# EAGLE design current_sense_INA260 (EAGLE 8.2.2)
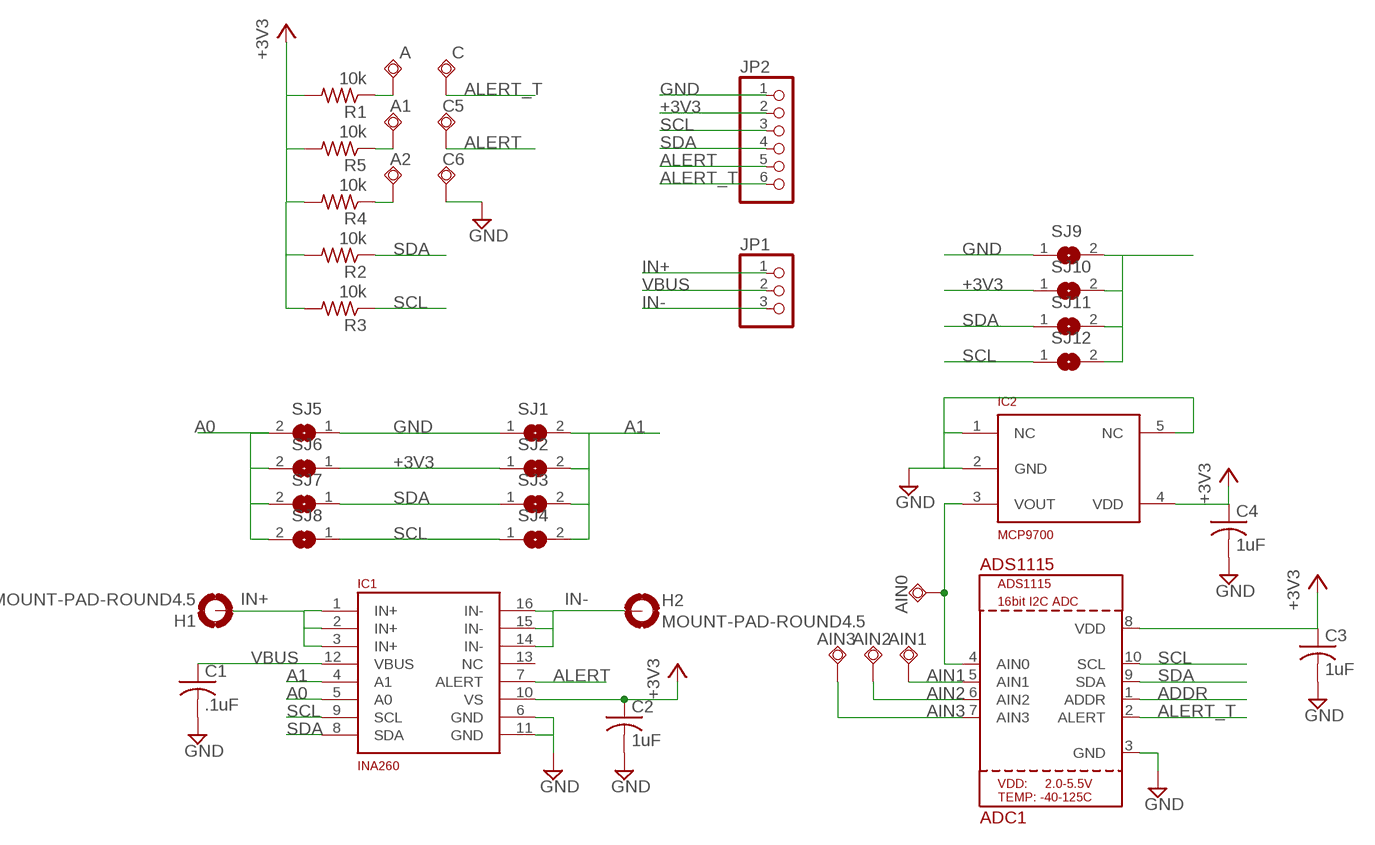
[diagram p0: schematic, sheet 1]

## Parts
A  TPSQTP20SQ  [TP20SQ]
A1  TPSQTP20SQ  [TP20SQ]
A2  TPSQTP20SQ  [TP20SQ]
ADC1  ADS1115  [MSOP10]
AIN0  TPSQTP20SQ  [TP20SQ]
AIN1  TPSQTP20SQ  [TP20SQ]
AIN2  TPSQTP20SQ  [TP20SQ]
AIN3  TPSQTP20SQ  [TP20SQ]
C  C  TPSQTP20SQ  [TP20SQ]
C1  .1uF  C-USC0805K  [C0805K]
C2  1uF  C-USC0805K  [C0805K]
C3  1uF  C-USC0805K  [C0805K]
C4  1uF  C-USC0805K  [C0805K]
C5  TPSQTP20SQ  [TP20SQ]
C6  TPSQTP20SQ  [TP20SQ]
H1  MOUNT-PAD-ROUND4.5  [4,5-PAD]
H2  MOUNT-PAD-ROUND4.5  [4,5-PAD]
IC1  INA260  [TSSOP16]
IC2  MCP9700  [SC70]
JP1  PINHD-1X3  [1X03]
JP2  PINHD-1X6  [1X06]
R1  10k  R-US_R0805  [R0805]
R2  10k  R-US_R0805  [R0805]
R3  10k  R-US_R0805  [R0805]
R4  10k  R-US_R0805  [R0805]
R5  10k  R-US_R0805  [R0805]
SJ1  SJ  [SJ]
SJ2  SJ  [SJ]
SJ3  SJ  [SJ]
SJ4  SJ  [SJ]
SJ5  SJ  [SJ]
SJ6  SJ  [SJ]
SJ7  SJ  [SJ]
SJ8  SJ  [SJ]
SJ9  SJ  [SJ]
SJ10  SJ  [SJ]
SJ11  SJ  [SJ]
SJ12  SJ  [SJ]

## Nets
+3V3: ADC1.8(VDD) C2.1 C3.1 C4.1 IC1.10(VS) IC2.4(VDD) JP2.2 R1.2 R2.2 R3.2 R4.2 R5.2 SJ2.1 SJ6.1 SJ10.1
A0: IC1.5(A0) SJ5.2 SJ6.2 SJ7.2 SJ8.2
A1: IC1.4(A1) SJ1.2 SJ2.2 SJ3.2 SJ4.2
ADDR: ADC1.1(ADDR) SJ9.2 SJ10.2 SJ11.2 SJ12.2
AIN1: ADC1.5(AIN1) AIN1.TP
AIN2: ADC1.6(AIN2) AIN2.TP
AIN3: ADC1.7(AIN3) AIN3.TP
ALERT: C5.TP IC1.7(ALERT) JP2.5
ALERT_T: ADC1.2(ALERT) C.TP JP2.6
GND: ADC1.3(GND) C1.2 C2.2 C3.2 C4.2 C6.TP IC1.6(GND) IC1.11(GND) IC2.1(NC) IC2.2(GND) IC2.5(NC) JP2.1 SJ1.1 SJ5.1 SJ9.1
IN+: H1.B4,5(MOUNT) IC1.1(IN+) IC1.2(IN+) IC1.3(IN+) JP1.1
IN-: H2.B4,5(MOUNT) IC1.14(IN-) IC1.15(IN-) IC1.16(IN-) JP1.3
N$1: A2.TP R4.1
N$2: A1.TP R5.1
N$3: A.TP R1.1
SCL: ADC1.10(SCL) IC1.9(SCL) JP2.3 R3.1 SJ4.1 SJ8.1 SJ12.1
SDA: ADC1.9(SDA) IC1.8(SDA) JP2.4 R2.1 SJ3.1 SJ7.1 SJ11.1
V_TEMP: ADC1.4(AIN0) AIN0.TP IC2.3(VOUT)
VBUS: C1.1 IC1.12(VBUS) JP1.2
Unconnected: IC1.13(NC)

## Library data of the parts
A A1 A2 AIN0 AIN1-AIN3 C C5 C6 = testpad:TPSQ: Test pad
ADC1 = vtgs:ADS1115
C1-C4 = rcl:C-US: CAPACITOR, American symbol
H1 H2 = holes:MOUNT-PAD-ROUND: MOUNTING PAD, round
IC1 = vtgs:INA260
IC2 = vtgs:MCP9700
JP1 = pinhead:PINHD-1X3: PIN HEADER
JP2 = pinhead:PINHD-1X6: PIN HEADER
R1-R5 = rcl:R-US_: RESISTOR, American symbol
SJ1-SJ12 = jumper:SJ: SMD solder JUMPER

## Board
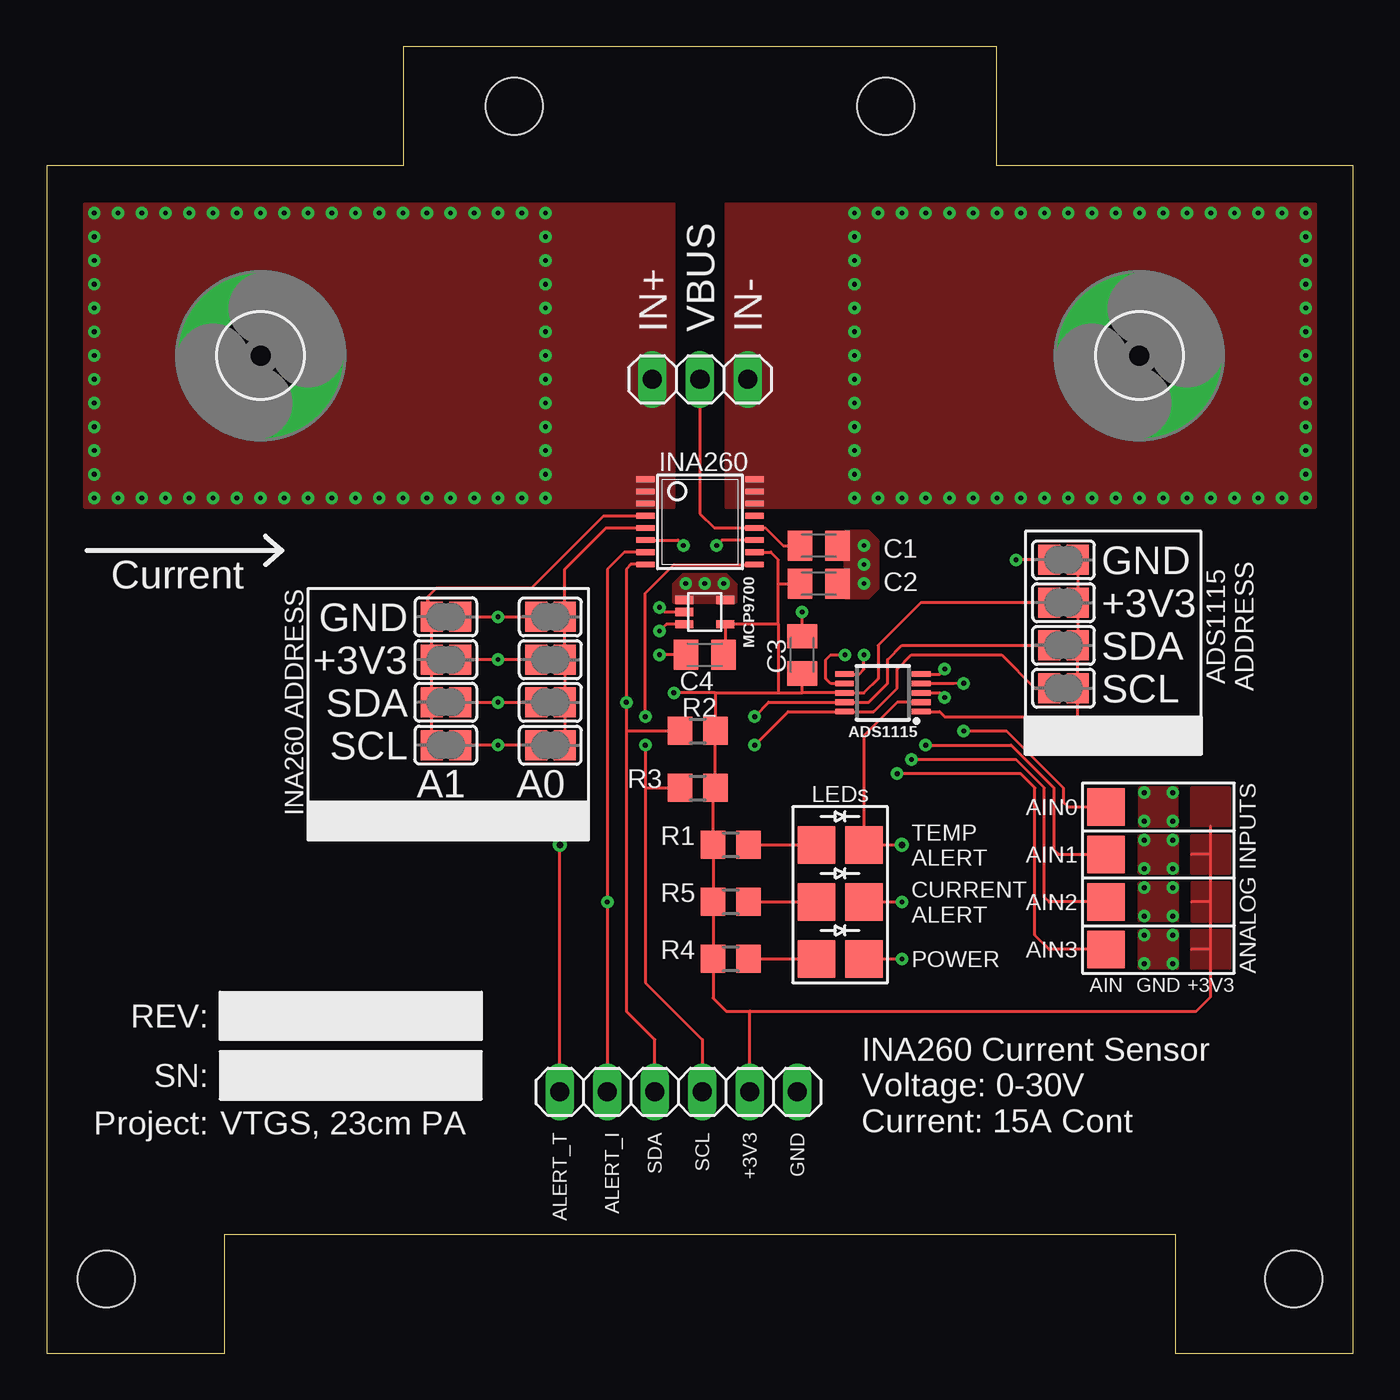
[diagram p1: board, top side]
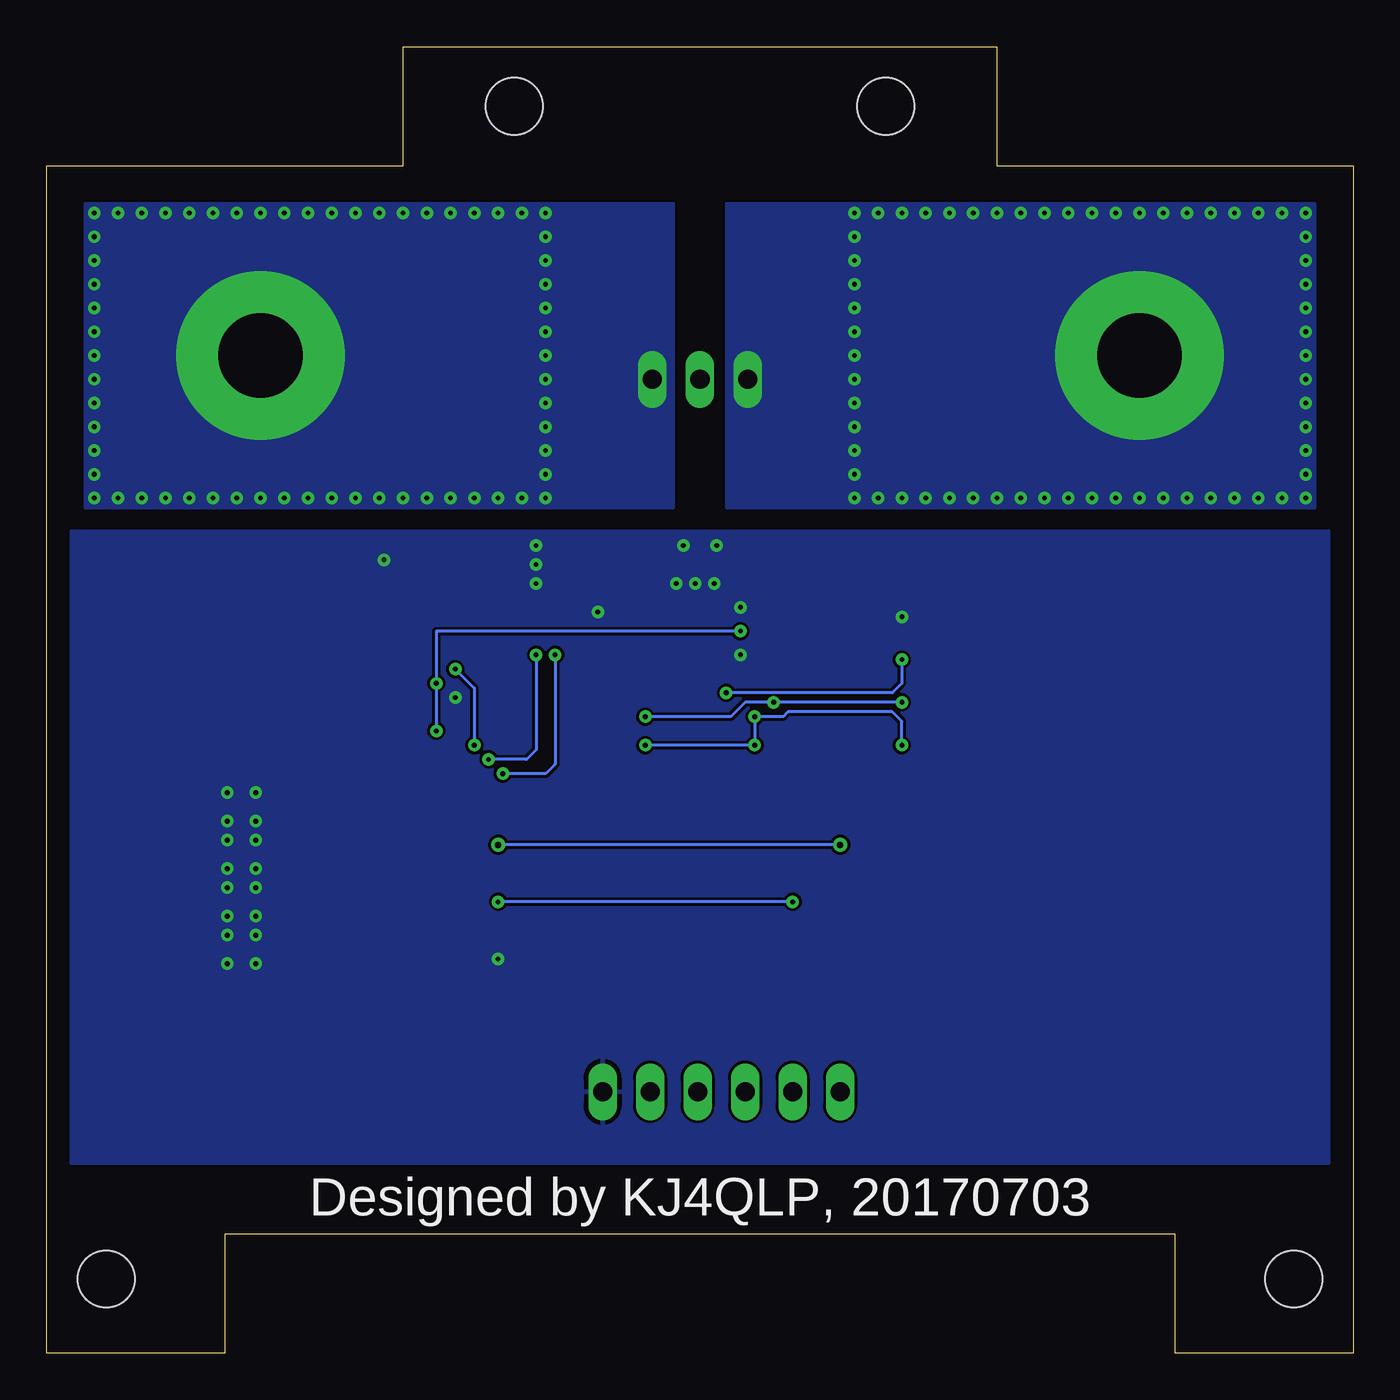
[diagram p2: board, bottom side, seen from below]

Size 69.85 x 69.85 mm. Coordinates in mm from the lower left corner, seen from the top.
Outline: 0,0 9.53,0 9.53,6.35 60.33,6.35 60.33,0 69.85,0 69.85,63.5 50.8,63.5 50.8,69.85 19.05,69.85 19.05,63.5 0,63.5 0,0
Copper layers (1*16): Top 0.035mm / dielectric 1.5mm / Bottom 0.035mm
Design rules "default *": minimum track width 6mil, minimum drill 10mil, track to track 6mil, track to pad 6mil, pad to pad 6mil, via to via 6mil, smd to smd 6mil, copper to edge 3mil, drill to drill 6mil, minimum pad ring 10mil, minimum via ring 8mil, stop-mask expansion 4mil, vias tented up to drill 0mil, thermal gap 10mil
Holes 3.05 mm at 25,66.67 44.85,66.67 3.17,3.97 66.67,3.97

### Footprints (pad centres in the part's own frame; a part is rotated, then mirrored left to right if it is on the bottom)
TP20SQ = smd 2 x 2: TP 0,0
MSOP10 = smd 0.3 x 1: 1 -1,-2.05; 2 -0.5,-2.05; 3 0,-2.05; 4 0.5,-2.05; 5 1,-2.05; 6 1,2.05; 7 0.5,2.05; 8 0,2.05; 9 -0.5,2.05; 10 -1,2.05
C0805K = smd 1.3 x 1.6: 1 -1,0; 2 1,0
4,5-PAD = drill 4.5 pad 9: B4,5 0,0
TSSOP16 = smd 0.305 x 0.991: 1 -2.275,-2.918; 2 -1.625,-2.918; 3 -0.975,-2.918; 4 -0.325,-2.918; 5 0.325,-2.918; 6 0.975,-2.918; 7 1.625,-2.918; 8 2.275,-2.918; 9 2.275,2.918; 10 1.625,2.918; 11 0.975,2.918; 12 0.325,2.918; 13 -0.325,2.918; 14 -0.975,2.918; 15 -1.625,2.918; 16 -2.275,2.918
SC70 = smd 0.45 x 0.95: 1 0.65,1.1; 2 0,1.1; 3 -0.65,1.1; 4 -0.65,-1.1; 5 0.65,-1.1
1X03 = drill 1.016 long: 1 -2.54,0; 2 0,0; 3 2.54,0
1X06 = drill 1.016 long: 1 -6.35,0; 2 -3.81,0; 3 -1.27,0; 4 1.27,0; 5 3.81,0; 6 6.35,0
R0805 = smd 1.3 x 1.5: 1 -0.95,0; 2 0.95,0
SJ = smd 1.168 x 1.6: 1 -0.762,0; 2 0.762,0

### Placement (x,y rotation side)
A  41.15,27.18 0 top
A1  41.15,24.13 0 top
A2  41.15,21.08 0 top
ADC1  44.7,35.31 90 top
AIN0  56.64,29.21 0 top
AIN1  56.64,26.67 0 top
AIN2  56.64,24.13 0 top
AIN3  56.64,21.59 0 top
C  43.69,27.18 0 top
C1  41.27,43.18 0 top
C2  41.27,41.15 0 top
C3  40.39,37.34 90 top
C4  35.18,37.34 180 top
C5  43.69,24.13 0 top
C6  43.69,21.08 0 top
H1  11.43,53.34 0 top
H2  58.42,53.34 0 top
IC1  34.92,44.45 270 top
IC2  35.18,39.62 90 top
JP1  34.92,52.07 0 top
JP2  33.78,13.97 180 top
R1  36.58,27.18 180 top
R2  34.8,33.27 0 top
R3  34.8,30.23 0 top
R4  36.58,21.08 180 top
R5  36.58,24.13 180 top
SJ1  21.34,39.37 180 top
SJ2  21.34,37.08 180 top
SJ3  21.34,34.8 180 top
SJ4  21.34,32.51 180 top
SJ5  26.92,39.37 0 top
SJ6  26.92,37.08 0 top
SJ7  26.92,34.8 0 top
SJ8  26.92,32.51 0 top
SJ9  54.36,42.42 0 top
SJ10  54.36,40.13 0 top
SJ11  54.36,37.85 0 top
SJ12  54.36,35.56 0 top

### Tracks (layer width: path | path; a pad name or v marks a point on that pad's centre or on a via)
+3V3  (via drill 0.25)
  Top 0.152: IC1.10 38.71,42.83 39.12,42.42 39.12,41.15 | SJ6.1 v24.13,37.08 SJ2.1 | 39.12,41.15 C2.1 | SJ10.1 46.74,40.13 44.45,37.85 44.45,36.07 43.69,35.31 ADC1.8 40.39,35.31 | 35.74,35.31 v33.53,35.31 | 40.39,35.31 C3.1 | 35.74,35.31 R2.2 R3.2 35.63,30.1 R1.2 R5.2 R4.2 35.63,18.98 36.32,18.29 37.59,18.29 | 35.74,35.31 39.12,35.31 | 39.12,35.31 40.39,35.31 | JP2.2 37.59,18.29 | 39.12,38.98 39.12,35.31 | 39.12,38.98 39.12,41.15 | 39.12,38.98 IC2.4 36.28,37.44 C4.1 | 37.59,18.29 61.47,18.29 62.23,19.05 62.23,21.59 | 62.23,26.67 61.21,26.67 | 62.23,26.67 62.23,28.19 | 62.23,24.13 61.21,24.13 | 62.23,24.13 62.23,26.67 | 62.23,21.59 61.21,21.59 | 62.23,21.59 62.23,24.13
  Bottom 0.152: v24.13,37.08 24.13,35.81 24.64,35.31 v33.53,35.31
  pour Top: 61.21,30.23 63.25,30.23 63.25,28.19 61.21,28.19
  pour Top: 61.21,27.69 63.25,27.69 63.25,25.65 61.21,25.65
  pour Top: 61.21,25.15 61.21,23.11 63.25,23.11 63.25,25.15
  pour Top: 61.21,22.61 63.25,22.61 63.25,20.57 61.21,20.57
A0
  Top 0.152: IC1.5 29.9,44.12 27.69,41.91 SJ5.2 SJ6.2 SJ7.2 SJ8.2
A1
  Top 0.152: SJ4.2 SJ3.2 SJ2.2 SJ1.2 20.32,40.39 20.83,40.89 25.91,40.89 29.79,44.77 IC1.4
ADDR
  Top 0.152: SJ9.2 SJ10.2 SJ11.2 SJ12.2 55.12,34.04 48.01,34.04 47.74,34.31 ADC1.1 46.77,34.29
AIN1  (via drill 0.25)
  Top 0.152: ADC1.5 47.74,36.31 v48.01,36.58 | v46.99,32.51 51.56,32.51 53.85,30.23 53.85,26.92 54.1,26.67 AIN1.TP
  Bottom 0.152: v48.01,36.58 46.99,35.56 v46.99,32.51
AIN2  (via drill 0.25)
  Top 0.152: ADC1.6 43.45,36.31 43.69,36.58 v43.69,37.34 | AIN2.TP 53.59,24.13 53.34,24.38 53.34,30.23 51.82,31.75 v46.23,31.75
  Bottom 0.152: v43.69,37.34 43.69,32.26 44.2,31.75 v46.23,31.75
AIN3  (via drill 0.25)
  Top 0.152: ADC1.7 41.92,35.81 41.66,36.07 41.66,37.08 41.91,37.34 v42.67,37.34 | AIN3.TP 53.59,21.59 52.83,22.35 52.83,30.23 52.07,30.99 v45.47,30.99
  Bottom 0.152: v42.67,37.34 42.67,31.5 43.18,30.99 v45.47,30.99
ALERT  (via drill 0.25)
  Top 0.152: IC1.7 30.89,42.83 29.97,41.91 v29.97,24.13 JP2.5 | C5.TP v45.72,24.13
  Bottom 0.152: v29.97,24.13 v45.72,24.13
ALERT_T  (via drill 0.35)
  Top 0.152: ADC1.2 45.47,34.81 43.69,33.02 C.TP v45.72,27.18 | JP2.6 v27.43,27.18
  Bottom 0.152: v27.43,27.18 v45.72,27.18
GND  (via drill 0.25)
  Top 0.152: IC1.11 36.11,43.48 v35.81,43.18 | SJ1.1 v24.13,39.37 SJ5.1 | IC1.6 33.74,43.48 v34.04,43.18 | SJ9.1 v51.82,42.42 | C3.2 v40.39,39.62 | ADC1.3 47.75,35.31 v48.01,35.05 | C4.2 v32.77,37.34 | IC2.2 33.02,39.62 v32.77,39.88 | C6.TP v45.72,21.08
  other vias: 43.69,43.18 43.69,42.16 43.69,41.15 35.18,41.15 34.16,41.15 36.2,41.15 60.2,29.97 60.2,27.43 60.2,24.89 60.2,22.35 60.2,23.37 60.2,25.91 60.2,28.45 60.2,20.83 58.67,29.97 58.67,28.45 58.67,27.43 58.67,25.91 58.67,24.89 58.67,23.37 58.67,22.35 58.67,20.83
  pour Top (no thermals): 42.67,43.94 42.67,40.39 43.94,40.39 44.45,40.89 44.45,43.43 43.94,43.94
  pour Bottom: 1.27,10.16 1.27,43.94 68.58,43.94 68.58,10.16
  pour Top (no thermals): 33.53,40.13 33.53,41.15 34.04,41.66 36.32,41.66 36.83,41.15 36.83,40.13
  pour Top: 58.42,30.23 58.42,28.19 60.45,28.19 60.45,30.23
  pour Top: 58.42,27.69 60.45,27.69 60.45,25.65 58.42,25.65
  pour Top: 58.42,25.15 60.45,25.15 60.45,23.11 58.42,23.11
  pour Top: 58.42,22.61 60.45,22.61 60.45,20.57 58.42,20.57
IN+  (via drill 0.25)
  other vias: 26.67,49.53 26.67,50.8 26.67,52.07 26.67,53.34 26.67,54.61 26.67,55.88 26.67,57.15 26.67,58.42 26.67,59.69 26.67,60.96 5.08,60.96 3.81,60.96 2.54,46.99 2.54,60.96 2.54,59.69 2.54,58.42 2.54,57.15 2.54,55.88 2.54,54.61 2.54,53.34 2.54,52.07 2.54,50.8 2.54,49.53 2.54,48.26 13.97,45.72 2.54,45.72 3.81,45.72 5.08,45.72 6.35,45.72 7.62,45.72 8.89,45.72 10.16,45.72 11.43,45.72 12.7,45.72 6.35,60.96 7.62,60.96 8.89,60.96 10.16,60.96 11.43,60.96 12.7,60.96 13.97,60.96 15.24,60.96 16.51,60.96 17.78,60.96 19.05,60.96 20.32,60.96 21.59,60.96 22.86,60.96 24.13,60.96 25.4,60.96 15.24,45.72 16.51,45.72 17.78,45.72 19.05,45.72 20.32,45.72 21.59,45.72 22.86,45.72 24.13,45.72 25.4,45.72 26.67,45.72 26.67,46.99 26.67,48.26
  pour Top (no thermals): 2.03,61.47 33.53,61.47 33.53,45.21 2.03,45.21
  pour Bottom (no thermals): 2.03,61.47 33.53,61.47 33.53,45.21 2.03,45.21
IN-  (via drill 0.25)
  other vias: 43.18,60.96 43.18,59.69 43.18,58.42 43.18,57.15 43.18,55.88 43.18,54.61 43.18,53.34 43.18,52.07 43.18,50.8 43.18,49.53 43.18,48.26 43.18,46.99 43.18,45.72 44.45,60.96 45.72,60.96 46.99,60.96 48.26,60.96 49.53,60.96 50.8,60.96 52.07,60.96 53.34,60.96 54.61,60.96 55.88,60.96 57.15,60.96 58.42,60.96 59.69,60.96 60.96,60.96 62.23,60.96 63.5,60.96 64.77,60.96 66.04,60.96 67.31,60.96 67.31,59.69 67.31,58.42 67.31,57.15 67.31,55.88 67.31,54.61 67.31,53.34 67.31,52.07 67.31,50.8 67.31,49.53 67.31,48.26 67.31,46.99 67.31,45.72 66.04,45.72 64.77,45.72 63.5,45.72 62.23,45.72 60.96,45.72 59.69,45.72 58.42,45.72 57.15,45.72 55.88,45.72 54.61,45.72 53.34,45.72 52.07,45.72 50.8,45.72 49.53,45.72 48.26,45.72 46.99,45.72 45.72,45.72 44.45,45.72
  pour Top (no thermals): 36.32,45.21 36.32,61.47 67.82,61.47 67.82,45.21
  pour Bottom (no thermals): 36.32,45.21 36.32,61.47 67.82,61.47 67.82,45.21
N$1
  Top 0.152: R4.1 A2.TP
N$2
  Top 0.152: R5.1 A1.TP
N$3
  Top 0.152: R1.1 A.TP
SCL  (via drill 0.25)
  Top 0.152: IC1.9 37.83,42.16 33.53,42.16 32,40.64 v32,34.04 | SJ8.1 v24.13,32.51 SJ4.1 | JP2.3 35.05,16.76 32,19.81 32,30.23 | v37.85,32.51 39.64,34.31 ADC1.10 44.21,34.31 45.47,35.56 45.47,36.58 46.23,37.34 51.05,37.34 52.83,35.56 SJ12.1 | v32,32.51 32,30.23 | 32,30.23 R3.1
  Bottom 0.152: v24.13,32.51 24.13,33.78 24.64,34.29 30.23,34.29 30.48,34.04 v32,34.04 v32,32.51 v37.85,32.51
SDA  (via drill 0.25)
  Top 0.152: IC1.8 31.23,42.17 30.99,41.91 v30.99,34.8 30.99,33.27 | SJ3.1 v24.13,34.8 SJ7.1 | JP2.4 32.51,16.76 30.99,18.29 30.99,33.27 | 30.99,33.27 R2.1 | v37.85,34.04 38.6,34.81 ADC1.9 43.95,34.81 44.96,35.81 44.96,37.08 45.72,37.85 SJ11.1
  Bottom 0.152: v24.13,34.8 v30.99,34.8 32.51,34.8 33.27,34.04 v37.85,34.04
V_TEMP  (via drill 0.25)
  Top 0.152: IC2.3 33.13,38.97 v32.77,38.61 | ADC1.4 48.51,35.81 v49.02,35.81 | v49.02,33.27 51.31,33.27 54.36,30.23 54.36,29.46 54.61,29.21 AIN0.TP
  Bottom 0.152: v32.77,38.61 49.02,38.61 v49.02,35.81 v49.02,33.27
VBUS
  Top 0.152: JP1.2 34.92,44.89 35.69,44.12 IC1.12 38.42,44.12 39.37,43.18 C1.1

### Text on the board
tPlace: IN+ | VBUS | IN- | Current | GND | +3V3 | GND | ADS1115 / ADDRESS | SDA | +3V3 | SCL | INA260 ADDRESS | SDA | SCL | A1 | A0 | LEDs | TEMP / ALERT | ANALOG INPUTS | CURRENT / ALERT | POWER | AIN | GND | +3V3 | REV: | SN: | Project: | VTGS, 23cm PA | ALERT_T | ALERT_I | SDA | SCL | +3V3 | GND | INA260 Current Sensor / Voltage: 0-30V / Current: 15A Cont
bPlace: Designed by KJ4QLP, 20170703